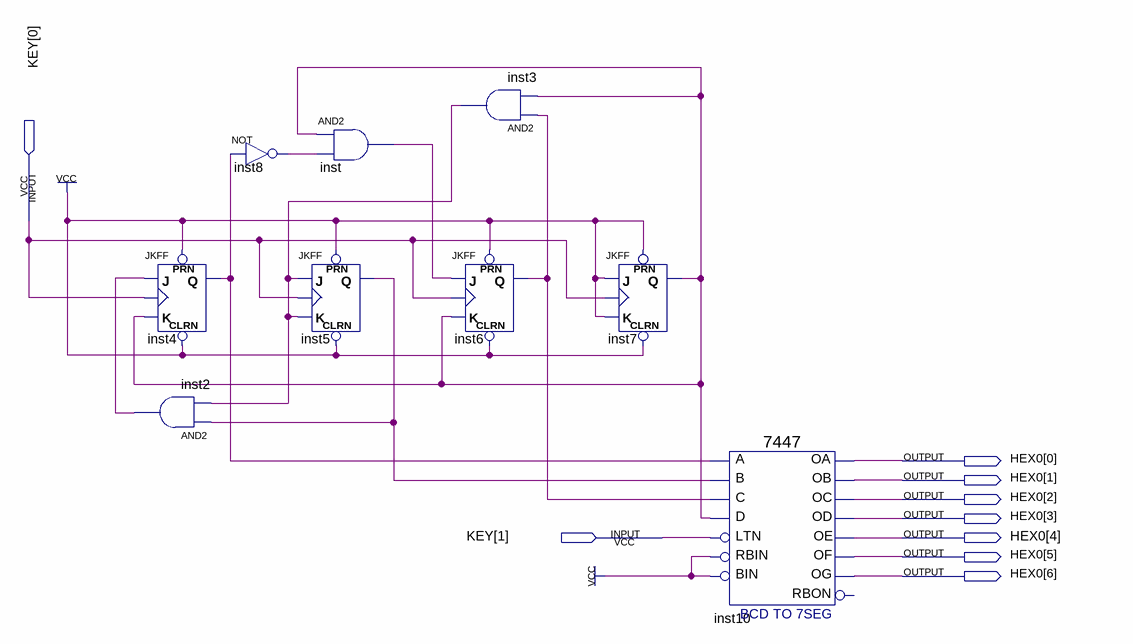
[diagram p0: schematic sheet]
// Quartus schematic diagrama.bdf as structural Verilog: 9 symbols, 9 pins
module diagrama (
  input  [1:0] KEY,
  output [6:0] HEX0
);

  wire inst2_out, inst3_out, inst4_q, inst5_q, inst6_q, inst7_q, inst8_out, inst_out;

  JKFF inst4 (.PRN(1'b1), .CLRN(1'b1), .K(inst7_q), .J(inst2_out), .CLK(KEY[0]), .Q(inst4_q));
  and inst2 (inst2_out, inst5_q, inst3_out);
  not inst8 (inst8_out, inst4_q);
  JKFF inst5 (.PRN(1'b1), .CLRN(1'b1), .K(inst3_out), .J(inst3_out), .CLK(KEY[0]), .Q(inst5_q));
  and inst (inst_out, inst7_q, inst8_out);
  and inst3 (inst3_out, inst6_q, inst7_q);
  JKFF inst6 (.PRN(1'b1), .CLRN(1'b1), .K(inst7_q), .J(inst_out), .CLK(KEY[0]), .Q(inst6_q));
  JKFF inst7 (.PRN(1'b1), .CLRN(1'b1), .K(1'b1), .J(1'b1), .CLK(KEY[0]), .Q(inst7_q));
  \7447  inst10 (
    .LTN(KEY[1]), .B(inst5_q), .C(inst6_q), .D(inst7_q), .RBIN(1'b1), .BIN(1'b1), .A(inst4_q), .OB(HEX0[1]),
    .OC(HEX0[2]), .OE(HEX0[4]), .OD(HEX0[3]), .OF(HEX0[5]), .OG(HEX0[6]), .OA(HEX0[0]));  // open: RBON
endmodule
